# Altium project SpaceVNXBaseBoard.PrjPcb (part 5 of 6)

## Sheet ZynqPower.SchDoc
size A3; Author: Carlos Barreiro; Organization: Escuela Técnica Superior de Ingeniería de Sistemas Informáticos de la Universidad Politécnica de Madrid; Address1: Campus Sur de la Universidad Politécnica de Madrid; Address2: Calle de Alan Turing, s/nº; Address3: Madrid 28031; Address4: España; DocumentNumber: 9; SheetNumber: 9; SheetTotal: 16
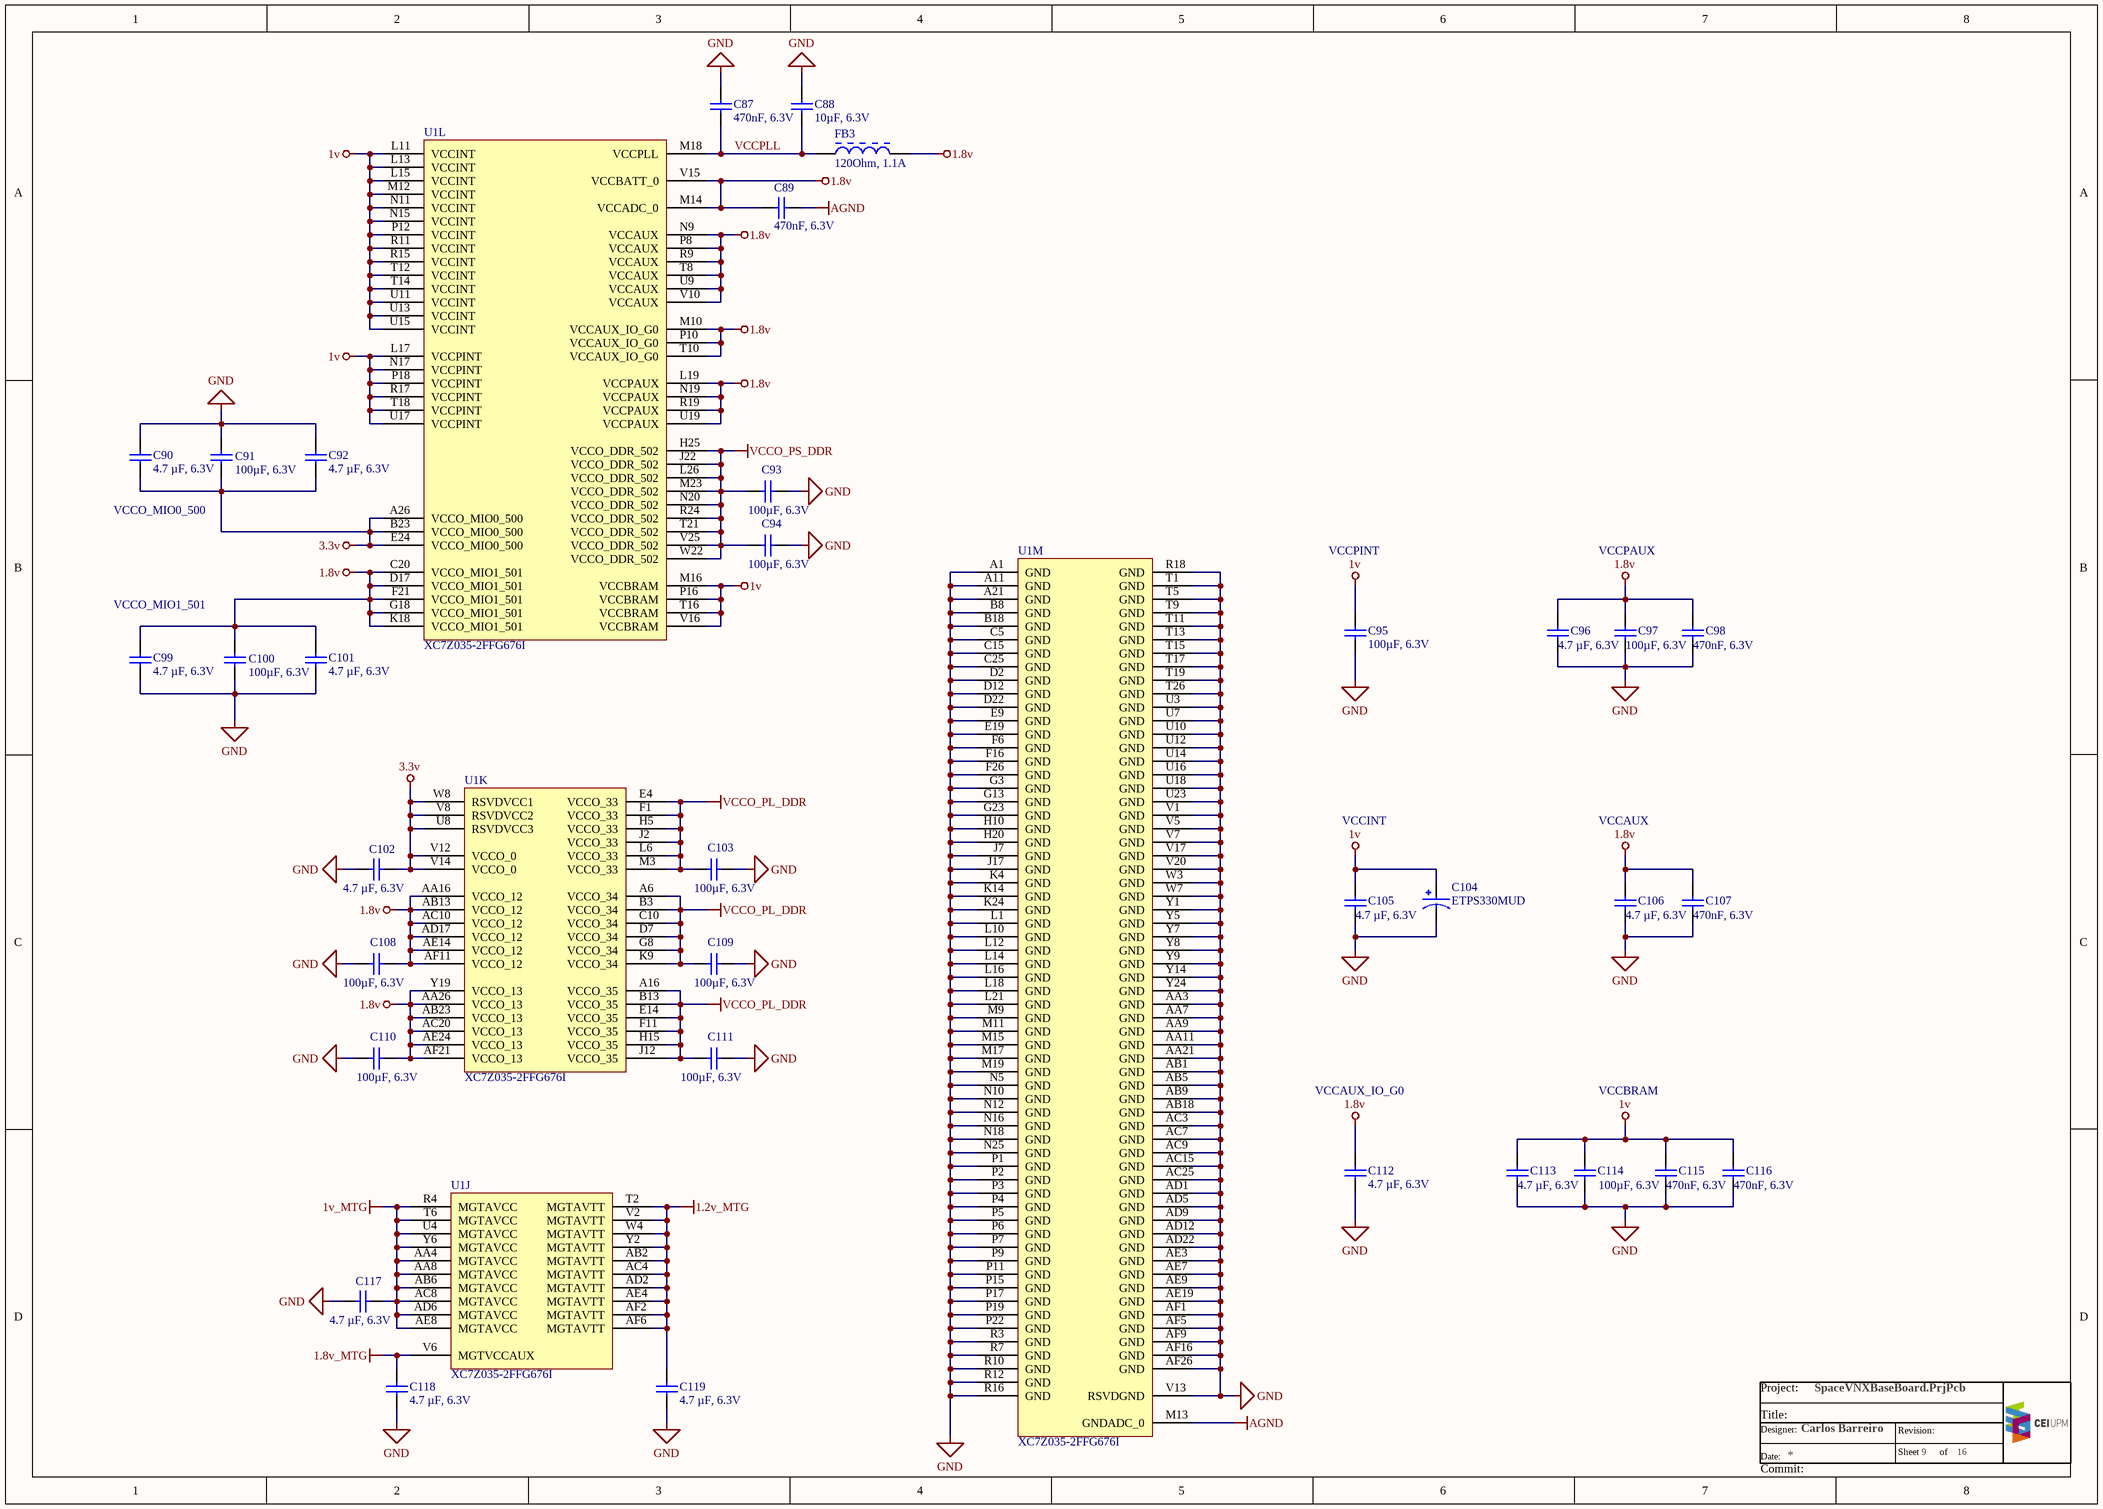
[diagram p12: ZynqPower.SchDoc]

### Parts
C87  470nF, 6.3V  [WURTH_WCAP-CSGP_0402]
C88  10µF, 6.3V  [WURTH_WCAP-CSGP_0402]
C89  470nF, 6.3V  [WURTH_WCAP-CSGP_0402]
C90  4.7 µF, 6.3V  [WURTH_WCAP-CSGP_0402]
C91  100µF, 6.3V  [WURTH_WCAP-CSGP_1206_H=1.6mm]
C92  4.7 µF, 6.3V  [WURTH_WCAP-CSGP_0402]
C93  100µF, 6.3V  [WURTH_WCAP-CSGP_1206_H=1.6mm]
C94  100µF, 6.3V  [WURTH_WCAP-CSGP_1206_H=1.6mm]
C95  100µF, 6.3V  [WURTH_WCAP-CSGP_1206_H=1.6mm]
C96  4.7 µF, 6.3V  [WURTH_WCAP-CSGP_0402]
C97  100µF, 6.3V  [WURTH_WCAP-CSGP_1206_H=1.6mm]
C98  470nF, 6.3V  [WURTH_WCAP-CSGP_0402]
C99  4.7 µF, 6.3V  [WURTH_WCAP-CSGP_0402]
C100  100µF, 6.3V  [WURTH_WCAP-CSGP_1206_H=1.6mm]
C101  4.7 µF, 6.3V  [WURTH_WCAP-CSGP_0402]
C102  4.7 µF, 6.3V  [WURTH_WCAP-CSGP_0402]
C103  100µF, 6.3V  [WURTH_WCAP-CSGP_1206_H=1.6mm]
C104  ETPS330MUD  [PANASONIC_B1S]
C105  4.7 µF, 6.3V  [WURTH_WCAP-CSGP_0402]
C106  4.7 µF, 6.3V  [WURTH_WCAP-CSGP_0402]
C107  470nF, 6.3V  [WURTH_WCAP-CSGP_0402]
C108  100µF, 6.3V  [WURTH_WCAP-CSGP_1206_H=1.6mm]
C109  100µF, 6.3V  [WURTH_WCAP-CSGP_1206_H=1.6mm]
C110  100µF, 6.3V  [WURTH_WCAP-CSGP_1206_H=1.6mm]
C111  100µF, 6.3V  [WURTH_WCAP-CSGP_1206_H=1.6mm]
C112  4.7 µF, 6.3V  [WURTH_WCAP-CSGP_0402]
C113  4.7 µF, 6.3V  [WURTH_WCAP-CSGP_0402]
C114  100µF, 6.3V  [WURTH_WCAP-CSGP_1206_H=1.6mm]
C115  470nF, 6.3V  [WURTH_WCAP-CSGP_0402]
C116  470nF, 6.3V  [WURTH_WCAP-CSGP_0402]
C117  4.7 µF, 6.3V  [WURTH_WCAP-CSGP_0402]
C118  4.7 µF, 6.3V  [WURTH_WCAP-CSGP_0402]
C119  4.7 µF, 6.3V  [WURTH_WCAP-CSGP_0402]
FB3  120Ohm, 1.1A  [WURTH-CBF_0402]
U1  XC7Z035-2FFG676I  [XILINX_FBG676]  (parts J,K,L,M of 13)

### Nets
1.2v_MTG: C119.2 U1.AB2(MGTAVTT) U1.AC4(MGTAVTT) U1.AD2(MGTAVTT) U1.AE4(MGTAVTT) U1.AF2(MGTAVTT) U1.AF6(MGTAVTT) U1.T2(MGTAVTT) U1.V2(MGTAVTT) U1.W4(MGTAVTT) U1.Y2(MGTAVTT)
1.8v: C89.2 C96.1 C97.2 C98.2 C99.2 C100.1 C101.2 C106.2 C107.2 C108.1 C110.1 C112.2 FB3.2 U1.AA16(VCCO_12) U1.AA26(VCCO_13) U1.AB13(VCCO_12) U1.AB23(VCCO_13) U1.AC10(VCCO_12) U1.AC20(VCCO_13) U1.AD17(VCCO_12) U1.AE14(VCCO_12) U1.AE24(VCCO_13) U1.AF11(VCCO_12) U1.AF21(VCCO_13) U1.C20(VCCO_MIO1_501) U1.D17(VCCO_MIO1_501) U1.F21(VCCO_MIO1_501) U1.G18(VCCO_MIO1_501) U1.K18(VCCO_MIO1_501) U1.L19(VCCPAUX) U1.M10(VCCAUX_IO_G0) U1.M14(VCCADC_0) U1.N9(VCCAUX) U1.N19(VCCPAUX) U1.P8(VCCAUX) U1.P10(VCCAUX_IO_G0) U1.R9(VCCAUX) U1.R19(VCCPAUX) U1.T8(VCCAUX) U1.T10(VCCAUX_IO_G0) U1.U9(VCCAUX) U1.U19(VCCPAUX) U1.V10(VCCAUX) U1.V15(VCCBATT_0) U1.Y19(VCCO_13)
1.8v_MTG: C118.2 U1.V6(MGTVCCAUX)
1v: C95.2 C104.1 C105.1 C113.1 C114.2 C115.2 C116.2 U1.L11(VCCINT) U1.L13(VCCINT) U1.L15(VCCINT) U1.L17(VCCPINT) U1.M12(VCCINT) U1.M16(VCCBRAM) U1.N11(VCCINT) U1.N15(VCCINT) U1.N17(VCCPINT) U1.P12(VCCINT) U1.P16(VCCBRAM) U1.P18(VCCPINT) U1.R11(VCCINT) U1.R15(VCCINT) U1.R17(VCCPINT) U1.T12(VCCINT) U1.T14(VCCINT) U1.T16(VCCBRAM) U1.T18(VCCPINT) U1.U11(VCCINT) U1.U13(VCCINT) U1.U15(VCCINT) U1.U17(VCCPINT) U1.V16(VCCBRAM)
1v_MTG: C117.2 U1.AA4(MGTAVCC) U1.AA8(MGTAVCC) U1.AB6(MGTAVCC) U1.AC8(MGTAVCC) U1.AD6(MGTAVCC) U1.AE8(MGTAVCC) U1.R4(MGTAVCC) U1.T6(MGTAVCC) U1.U4(MGTAVCC) U1.Y6(MGTAVCC)
3.3v: C90.2 C91.1 C92.2 C102.2 U1.A26(VCCO_MIO0_500) U1.B23(VCCO_MIO0_500) U1.E24(VCCO_MIO0_500) U1.U8(RSVDVCC3) U1.V8(RSVDVCC2) U1.V12(VCCO_0) U1.V14(VCCO_0) U1.W8(RSVDVCC1)
AGND: C89.1 U1.M13(GNDADC_0)
GND: C87.2 C88.2 C90.1 C91.2 C92.1 C93.2 C94.2 C95.1 C96.2 C97.1 C98.1 C99.1 C100.2 C101.1 C102.1 C103.2 C104.2 C105.2 C106.1 C107.1 C108.2 C109.2 C110.2 C111.2 C112.1 C113.2 C114.1 C115.1 C116.1 C117.1 C118.1 C119.1 U1.A1(GND) U1.A11(GND) U1.A21(GND) U1.AA3(GND) U1.AA7(GND) U1.AA9(GND) U1.AA11(GND) U1.AA21(GND) U1.AB1(GND) U1.AB5(GND) U1.AB9(GND) U1.AB18(GND) U1.AC3(GND) U1.AC7(GND) U1.AC9(GND) U1.AC15(GND) U1.AC25(GND) U1.AD1(GND) U1.AD5(GND) U1.AD9(GND) U1.AD12(GND) U1.AD22(GND) U1.AE3(GND) U1.AE7(GND) U1.AE9(GND) U1.AE19(GND) U1.AF1(GND) U1.AF5(GND) U1.AF9(GND) U1.AF16(GND) U1.AF26(GND) U1.B8(GND) U1.B18(GND) U1.C5(GND) U1.C15(GND) U1.C25(GND) U1.D2(GND) U1.D12(GND) U1.D22(GND) U1.E9(GND) U1.E19(GND) U1.F6(GND) U1.F16(GND) U1.F26(GND) U1.G3(GND) U1.G13(GND) U1.G23(GND) U1.H10(GND) U1.H20(GND) U1.J7(GND) U1.J17(GND) U1.K4(GND) U1.K14(GND) U1.K24(GND) U1.L1(GND) U1.L10(GND) U1.L12(GND) U1.L14(GND) U1.L16(GND) U1.L18(GND) U1.L21(GND) U1.M9(GND) U1.M11(GND) U1.M15(GND) U1.M17(GND) U1.M19(GND) U1.N5(GND) U1.N10(GND) U1.N12(GND) U1.N16(GND) U1.N18(GND) U1.N25(GND) U1.P1(GND) U1.P2(GND) U1.P3(GND) U1.P4(GND) U1.P5(GND) U1.P6(GND) U1.P7(GND) U1.P9(GND) U1.P11(GND) U1.P15(GND) U1.P17(GND) U1.P19(GND) U1.P22(GND) U1.R3(GND) U1.R7(GND) U1.R10(GND) U1.R12(GND) U1.R16(GND) U1.R18(GND) U1.T1(GND) U1.T5(GND) U1.T9(GND) U1.T11(GND) U1.T13(GND) U1.T15(GND) U1.T17(GND) U1.T19(GND) U1.T26(GND) U1.U3(GND) U1.U7(GND) U1.U10(GND) U1.U12(GND) U1.U14(GND) U1.U16(GND) U1.U18(GND) U1.U23(GND) U1.V1(GND) U1.V5(GND) U1.V7(GND) U1.V13(RSVDGND) U1.V17(GND) U1.V20(GND) U1.W3(GND) U1.W7(GND) U1.Y1(GND) U1.Y5(GND) U1.Y7(GND) U1.Y8(GND) U1.Y9(GND) U1.Y14(GND) U1.Y24(GND)
VCCO_PL_DDR: C103.1 C109.1 C111.1 U1.A6(VCCO_34) U1.A16(VCCO_35) U1.B3(VCCO_34) U1.B13(VCCO_35) U1.C10(VCCO_34) U1.D7(VCCO_34) U1.E4(VCCO_33) U1.E14(VCCO_35) U1.F1(VCCO_33) U1.F11(VCCO_35) U1.G8(VCCO_34) U1.H5(VCCO_33) U1.H15(VCCO_35) U1.J2(VCCO_33) U1.J12(VCCO_35) U1.K9(VCCO_34) U1.L6(VCCO_33) U1.M3(VCCO_33)
VCCO_PS_DDR: C93.1 C94.1 U1.H25(VCCO_DDR_502) U1.J22(VCCO_DDR_502) U1.L26(VCCO_DDR_502) U1.M23(VCCO_DDR_502) U1.N20(VCCO_DDR_502) U1.R24(VCCO_DDR_502) U1.T21(VCCO_DDR_502) U1.V25(VCCO_DDR_502) U1.W22(VCCO_DDR_502)
VCCPLL: C87.1 C88.1 FB3.1 U1.M18(VCCPLL)

### Notes on the sheet
- VCCO_MIO0_500
- VCCPINT
- VCCPAUX
- VCCO_MIO1_501
- VCCINT
- VCCAUX
- VCCAUX_IO_G0
- VCCBRAM
- Project:
- Title:
- Date:
- Designer:
- Sheet
- Revision:
- of
- Commit:

### Library data of the parts
C87 C89 C98 C107 C115 C116 = 885012105004: as C120 on sheet Clock; ComponentLink1Description: Manufacturer; ComponentLink1URL: http://www.we-online.de; ComponentLink2Description: Datasheet; ComponentLink2URL: https://www.we-online.com/catalog/datasheet/885012105004.pdf; Operating Temperature: -55 to +85degC; Packaging: Tape and Reel; Manufacturer Part Number: 885012105004; Published Date: April 2021; Ceramic Type: X5R; Height: 0.5mm; Mounting Technology: SMT; Size: 0402; Capacitance: 470nF; Supplier 1: Digi-Key; Supplier 2: Mouser; Supplier Part Number 1: 732-7481-1-ND; Supplier Part Number 2: 710-885012105004
C88 = 885012105020: as C121 on sheet Clock; ComponentLink1Description: Manufacturer; ComponentLink1URL: http://www.we-online.de; ComponentLink2Description: Datasheet; ComponentLink2URL: https://www.we-online.com/catalog/datasheet/885012105020.pdf; Operating Temperature: -55 to +85degC; Packaging: Tape and Reel; Manufacturer Part Number: 885012105020; Published Date: April 2021; Ceramic Type: X5R; Height: 0.5mm; Mounting Technology: SMT; Size: 0402; Capacitance: 10uF; Q-Factor min.: -
C90 C92 C96 C99 C101 C102 C105 C106 C112 C113 C117-C119 = GRM155C80J475MEAAD: Multilayer Ceramic Capacitors MLCC, size 0402, X5R, 4.7 µF, 6.3V; Manufacturer: Murata; Rated Voltage: 6.3VDC; Ceramic Type: X6S; Capacitance Tolerance: +/-20%; Dissipation Factor max.: 10%; Capacitance: 4.7 µF; Operating Temperature: -55 to +105degC; Packaging: Tape and Reel; Manufacturer Part Number: GRM155C80J475MEAAD; Height: 0.5mm; Mounting Technology: SMT; Size: 0402; Supplier 1: Digi-Key; Supplier 2: Mouser; Supplier Part Number 1: 490-14458-1-ND; Supplier Part Number 2: 81-GRM155C80J475MEAD
C91 C93-C95 C97 C100 C103 C108-C111 C114 = 885012108005: WCAP-CSGP Multilayer Ceramic Chip Capacitor, General Purpose, size 1206, X5R, 100uF, 6.3V; Manufacturer: Wurth Elektronik; Rated Voltage: 6.3VDC; Isolation Resistance  min.: 0.001GOhm; Capacitance Tolerance: +/-20%; Dissipation Factor max.: 10%; Technical Reference: X5R1206107M6R3DFCT10000; ComponentLink1Description: Manufacturer; ComponentLink1URL: http://www.we-online.de; ComponentLink2Description: Datasheet; ComponentLink2URL: https://www.we-online.com/catalog/datasheet/885012108005.pdf; Operating Temperature: -55 to +85degC; Packaging: Tape and Reel; Manufacturer Part Number: 885012108005; Published Date: April 2021; Ceramic Type: X5R; Height: 1.6mm; Mounting Technology: SMT; Size: 1206; Capacitance: 100uF; Q-Factor min.: -
C104 = ETPS330MUD: Conductive Polymer Tantalum Solid Capacitors; Rated capacitance range (µF): 330.00; Rated voltage (DC) (V): 2.50; MF: Panasonic; Package: B1S; MP: ETPS330MUD; Supplier 1: Digi-Key; Supplier Part Number 1: 10-ETPS330MUDDKR-ND
FB3 = 74279271: as FB4 on sheet Clock; ComponentLink1Description: Manufacturer; ComponentLink1URL: http://www.we-online.de; ComponentLink2Description: Datasheet; ComponentLink2URL: https://www.we-online.com/catalog/datasheet/74279271.pdf; Operating Temperature: -55 to +125degC; Packaging: Tape and Reel; Published Date: December 2021; Rated Current: 1.1A; Manufacturer Part Number: 74279271; Impedance @100MHz: 120Ohm; Mounting Technology: SMT; Size: 0402; Height: 0.5mm; Length: 1mm; Width: 0.5mm
U1 = XC7Z035-2FFG676I: 667 MHz Zynq™-7000 AP SoC, 130 PS I/O, 254 FPGA I/O, 676-Ball BGA, Speed Grade 1, Commercial Grade, Pb-Free; PartNumber: XC7Z035-2FBG676I; LUTs: 171,900; Extensible Block RAM (# 36Kb Blocks): 17.6Mb (500); Speed Grade: -2; Flip Flops: 343,800; ComponentLink5Description: Packaging and Pinout; ComponentLink4Description: Package File; ComponentLink5URL: http://www.xilinx.com/support/documentation/user_guides/ug865-Zynq-7000-Pkg-Pinout.pdf; Generic Part Number: XC7Z035; ComponentLink1Description: Datasheet; ComponentLink2Description: Package Specification; ComponentLink3URL: http://www.xilinx.com/support/documentation/data_sheets/ds191-XC7Z030-XC7Z045-data-sheet.pdf; ComponentLink1URL: http://www.xilinx.com/support/documentation/data_sheets/ds190-Zynq-7000-Overview.pdf; ComponentLink6Description: PCB and Layout Guide; Package: FBG676; ComponentLink3Description: DC and AC Switching Characteristics; ComponentLink6URL: http://www.xilinx.com/support/documentation/user_guides/ug483_7Series_PCB.pdf; RoHS: Pb-Free; ComponentLink4URL: http://www.xilinx.com/support/packagefiles/z7packages/xc7z030fbg676pkg.txt; ComponentLink2URL: http://www.xilinx.com/support/documentation/user_guides/ug475_7Series_Pkg_Pinout.pdf; PackageDescription: Flip-Chip Lidless BGA, Body 27 x 27 mm, 1.0 mm Pitch; Supplier 1: Digi-Key; Supplier 2: Mouser; Supplier Part Number 1: XC7Z035-2FFG676I-ND; Supplier Part Number 2: 217-XC7Z035-2FFG676I

## Sheet PS_Ethernet.SchDoc: PS_Ethernet
size A3; Author: Carlos Barreiro; Organization: Escuela Técnica Superior de Ingeniería de Sistemas Informáticos de la Universidad Politécnica de Madrid; Address1: Campus Sur de la Universidad Politécnica de Madrid; Address2: Calle de Alan Turing, s/nº; Address3: Madrid 28031; Address4: España; DocumentNumber: 14; Revision: A; SheetNumber: 14; SheetTotal: 16
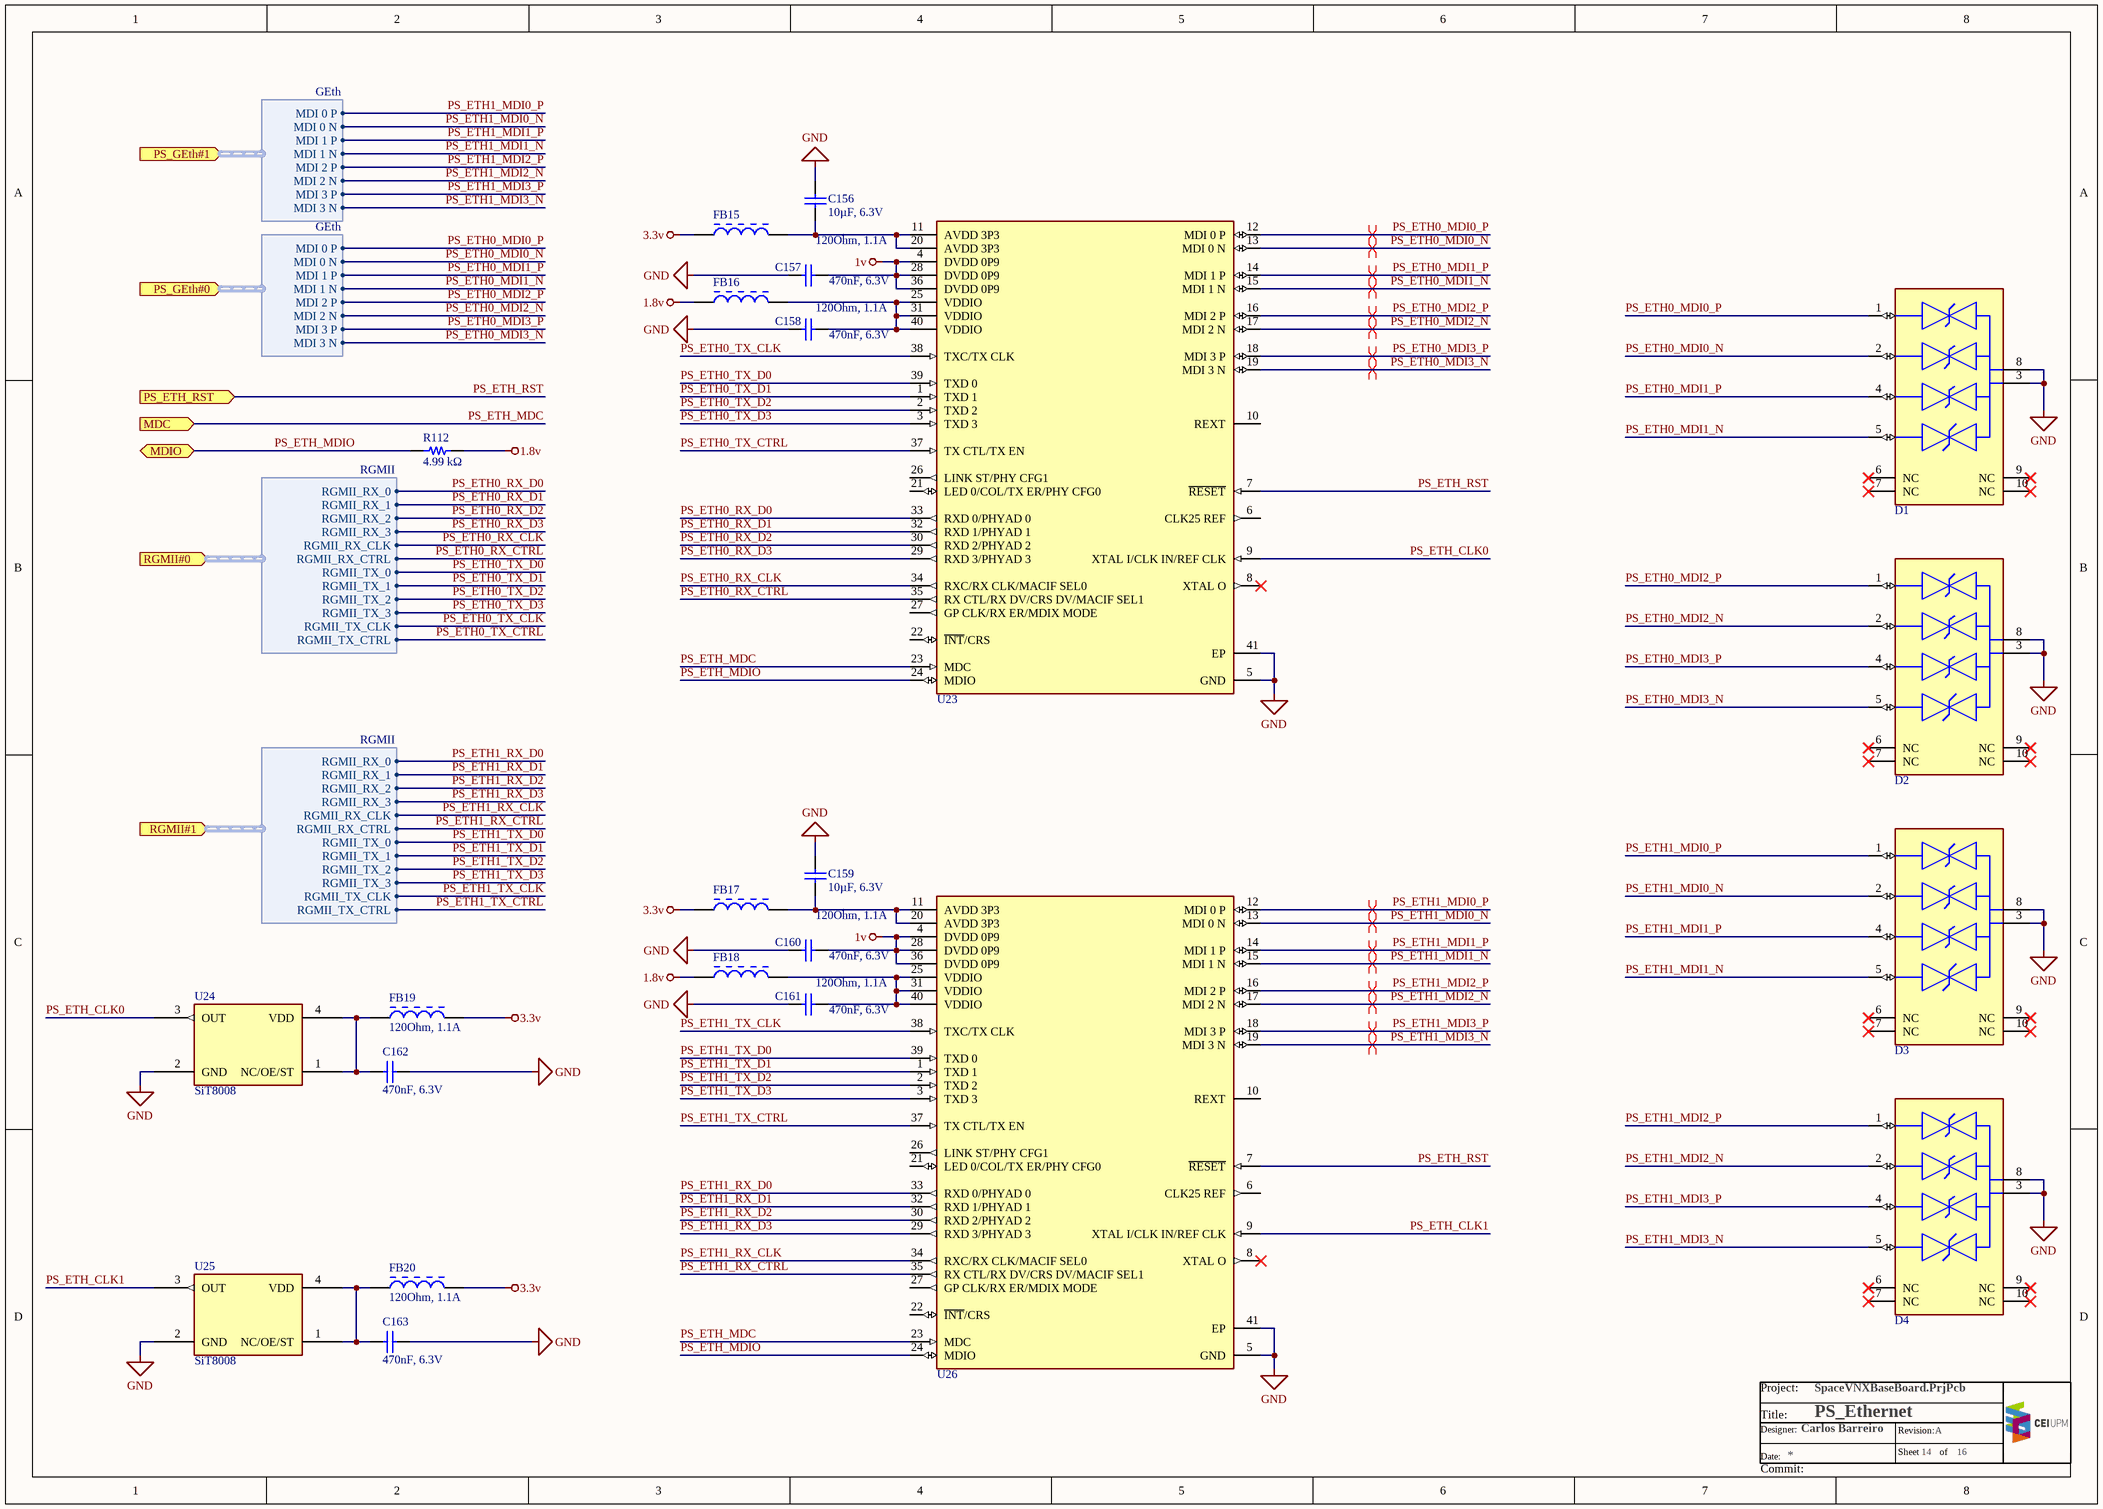
[diagram p13: PS_Ethernet.SchDoc]

### Parts
C156  10µF, 6.3V  [WURTH_WCAP-CSGP_0402]
C157  470nF, 6.3V  [WURTH_WCAP-CSGP_0402]
C158  470nF, 6.3V  [WURTH_WCAP-CSGP_0402]
C159  10µF, 6.3V  [WURTH_WCAP-CSGP_0402]
C160  470nF, 6.3V  [WURTH_WCAP-CSGP_0402]
C161  470nF, 6.3V  [WURTH_WCAP-CSGP_0402]
C162  470nF, 6.3V  [WURTH_WCAP-CSGP_0402]
C163  470nF, 6.3V  [WURTH_WCAP-CSGP_0402]
D1  ESD204DQAR  [TEXAS_USON10]  (value not drawn)
D2  ESD204DQAR  [TEXAS_USON10]  (value not drawn)
D3  ESD204DQAR  [TEXAS_USON10]  (value not drawn)
D4  ESD204DQAR  [TEXAS_USON10]  (value not drawn)
FB15  120Ohm, 1.1A  [WURTH-CBF_0402]
FB16  120Ohm, 1.1A  [WURTH-CBF_0402]
FB17  120Ohm, 1.1A  [WURTH-CBF_0402]
FB18  120Ohm, 1.1A  [WURTH-CBF_0402]
FB19  120Ohm, 1.1A  [WURTH-CBF_0402]
FB20  120Ohm, 1.1A  [WURTH-CBF_0402]
R112  4.99 kΩ  [PANASONIC_ERJ2G_0402]
U23  ADIN1300CCPZ  [ADI_LFCSP40]  (value not drawn)
U24  SiT8008  [SiTime_5032_4]
U25  SiT8008  [SiTime_5032_4]
U26  ADIN1300CCPZ  [ADI_LFCSP40]  (value not drawn)

### Ports
MDC (in), MDIO (bidir), PS_ETH_RST (in), PS_GEth#0 (in, harness GEth), PS_GEth#1 (in, harness GEth), RGMII#0 (in, harness RGMII), RGMII#1 (in, harness RGMII)

### Harnesses
RGMII: RGMII_RX_0, RGMII_RX_1, RGMII_RX_2, RGMII_RX_3, RGMII_RX_CLK, RGMII_RX_CTRL, RGMII_TX_0, RGMII_TX_1, RGMII_TX_2, RGMII_TX_3, RGMII_TX_CLK, RGMII_TX_CTRL
GEth: MDI 0 P, MDI 0 N, MDI 1 P, MDI 1 N, MDI 2 P, MDI 2 N, MDI 3 P, MDI 3 N

### Nets
1.8v: FB16.1 FB18.1 R112.2
1v: C157.2 C160.2 U23.4(DVDD_0P9) U23.28(DVDD_0P9) U23.36(DVDD_0P9) U26.4(DVDD_0P9) U26.28(DVDD_0P9) U26.36(DVDD_0P9)
3.3v: FB15.1 FB17.1 FB19.2 FB20.2
GND: C156.2 C157.1 C158.1 C159.2 C160.1 C161.1 C162.1 C163.1 D1.3(GND) D1.8(GND) D2.3(GND) D2.8(GND) D3.3(GND) D3.8(GND) D4.3(GND) D4.8(GND) U23.5(GND) U23.41(EP) U24.2(GND) U25.2(GND) U26.5(GND) U26.41(EP)
PS_ETH0_MDI0_N: D1.2(IO2) U23.13(MDI_0_N) ; port PS_GEth#0.MDI 0 N
PS_ETH0_MDI0_P: D1.1(IO1) U23.12(MDI_0_P) ; port PS_GEth#0.MDI 0 P
PS_ETH0_MDI1_N: D1.5(IO4) U23.15(MDI_1_N) ; port PS_GEth#0.MDI 1 N
PS_ETH0_MDI1_P: D1.4(IO3) U23.14(MDI_1_P) ; port PS_GEth#0.MDI 1 P
PS_ETH0_MDI2_N: D2.2(IO2) U23.17(MDI_2_N) ; port PS_GEth#0.MDI 2 N
PS_ETH0_MDI2_P: D2.1(IO1) U23.16(MDI_2_P) ; port PS_GEth#0.MDI 2 P
PS_ETH0_MDI3_N: D2.5(IO4) U23.19(MDI_3_N) ; port PS_GEth#0.MDI 3 N
PS_ETH0_MDI3_P: D2.4(IO3) U23.18(MDI_3_P) ; port PS_GEth#0.MDI 3 P
PS_ETH0_RX_CLK: U23.34(RXC/RX_CLK/MACIF_SEL0) ; port RGMII#0.RGMII_RX_CLK
PS_ETH0_RX_CTRL: U23.35(RX_CTL/RX_DV/CRS_DV/MACIF_SEL1) ; port RGMII#0.RGMII_RX_CTRL
PS_ETH0_RX_D0: U23.33(RXD_0/PHYAD_0) ; port RGMII#0.RGMII_RX_0
PS_ETH0_RX_D1: U23.32(RXD_1/PHYAD_1) ; port RGMII#0.RGMII_RX_1
PS_ETH0_RX_D2: U23.30(RXD_2/PHYAD_2) ; port RGMII#0.RGMII_RX_2
PS_ETH0_RX_D3: U23.29(RXD_3/PHYAD_3) ; port RGMII#0.RGMII_RX_3
PS_ETH0_TX_CLK: U23.38(TXC/TX_CLK) ; port RGMII#0.RGMII_TX_CLK
PS_ETH0_TX_CTRL: U23.37(TX_CTL/TX_EN) ; port RGMII#0.RGMII_TX_CTRL
PS_ETH0_TX_D0: U23.39(TXD_0) ; port RGMII#0.RGMII_TX_0
PS_ETH0_TX_D1: U23.1(TXD_1) ; port RGMII#0.RGMII_TX_1
PS_ETH0_TX_D2: U23.2(TXD_2) ; port RGMII#0.RGMII_TX_2
PS_ETH0_TX_D3: U23.3(TXD_3) ; port RGMII#0.RGMII_TX_3
PS_ETH1_MDI0_N: D3.2(IO2) U26.13(MDI_0_N) ; port PS_GEth#1.MDI 0 N
PS_ETH1_MDI0_P: D3.1(IO1) U26.12(MDI_0_P) ; port PS_GEth#1.MDI 0 P
PS_ETH1_MDI1_N: D3.5(IO4) U26.15(MDI_1_N) ; port PS_GEth#1.MDI 1 N
PS_ETH1_MDI1_P: D3.4(IO3) U26.14(MDI_1_P) ; port PS_GEth#1.MDI 1 P
PS_ETH1_MDI2_N: D4.2(IO2) U26.17(MDI_2_N) ; port PS_GEth#1.MDI 2 N
PS_ETH1_MDI2_P: D4.1(IO1) U26.16(MDI_2_P) ; port PS_GEth#1.MDI 2 P
PS_ETH1_MDI3_N: D4.5(IO4) U26.19(MDI_3_N) ; port PS_GEth#1.MDI 3 N
PS_ETH1_MDI3_P: D4.4(IO3) U26.18(MDI_3_P) ; port PS_GEth#1.MDI 3 P
PS_ETH1_RX_CLK: U26.34(RXC/RX_CLK/MACIF_SEL0) ; port RGMII#1.RGMII_RX_CLK
PS_ETH1_RX_CTRL: U26.35(RX_CTL/RX_DV/CRS_DV/MACIF_SEL1) ; port RGMII#1.RGMII_RX_CTRL
PS_ETH1_RX_D0: U26.33(RXD_0/PHYAD_0) ; port RGMII#1.RGMII_RX_0
PS_ETH1_RX_D1: U26.32(RXD_1/PHYAD_1) ; port RGMII#1.RGMII_RX_1
PS_ETH1_RX_D2: U26.30(RXD_2/PHYAD_2) ; port RGMII#1.RGMII_RX_2
PS_ETH1_RX_D3: U26.29(RXD_3/PHYAD_3) ; port RGMII#1.RGMII_RX_3
PS_ETH1_TX_CLK: U26.38(TXC/TX_CLK) ; port RGMII#1.RGMII_TX_CLK
PS_ETH1_TX_CTRL: U26.37(TX_CTL/TX_EN) ; port RGMII#1.RGMII_TX_CTRL
PS_ETH1_TX_D0: U26.39(TXD_0) ; port RGMII#1.RGMII_TX_0
PS_ETH1_TX_D1: U26.1(TXD_1) ; port RGMII#1.RGMII_TX_1
PS_ETH1_TX_D2: U26.2(TXD_2) ; port RGMII#1.RGMII_TX_2
PS_ETH1_TX_D3: U26.3(TXD_3) ; port RGMII#1.RGMII_TX_3
PS_ETH_CLK0: U23.9(XTAL_I/CLK_IN/REF_CLK) U24.3(OUT)
PS_ETH_CLK1: U25.3(OUT) U26.9(XTAL_I/CLK_IN/REF_CLK)
PS_ETH_MDC: U23.23(MDC) U26.23(MDC) ; port MDC
PS_ETH_MDIO: R112.1 U23.24(MDIO) U26.24(MDIO) ; port MDIO
PS_ETH_RST: U23.7(~{RESET}) U26.7(~{RESET}) ; port PS_ETH_RST
NetC156_1: C156.1 FB15.2 U23.11(AVDD_3P3) U23.20(AVDD_3P3)
NetC158_2: C158.2 FB16.2 U23.25(VDDIO) U23.31(VDDIO) U23.40(VDDIO)
NetC159_1: C159.1 FB17.2 U26.11(AVDD_3P3) U26.20(AVDD_3P3)
NetC161_2: C161.2 FB18.2 U26.25(VDDIO) U26.31(VDDIO) U26.40(VDDIO)
NetC162_2: C162.2 FB19.1 U24.1(NC/OE/ST) U24.4(VDD)
NetC163_2: C163.2 FB20.1 U25.1(NC/OE/ST) U25.4(VDD)

Not connected (* = marked no-connect by the designer): D1 6(NC)* 7(NC)* 9(NC)* 10(NC)*; D2 6(NC)* 7(NC)* 9(NC)* 10(NC)*; D3 6(NC)* 7(NC)* 9(NC)* 10(NC)*; D4 6(NC)* 7(NC)* 9(NC)* 10(NC)*; U23 6(CLK25_REF) 8(XTAL_O)* 10(REXT) 21(LED_0/COL/TX_ER/PHY_CFG0) 22(~{INT}/CRS) 26(LINK_ST/PHY_CFG1) 27(GP_CLK/RX_ER/MDIX_MODE); U26 6(CLK25_REF) 8(XTAL_O)* 10(REXT) 21(LED_0/COL/TX_ER/PHY_CFG0) 22(~{INT}/CRS) 26(LINK_ST/PHY_CFG1) 27(GP_CLK/RX_ER/MDIX_MODE)

### Layout directives
differential pair: PS_ETH0_MDI0_N, PS_ETH0_MDI0_P, PS_ETH0_MDI1_N, PS_ETH0_MDI1_P, PS_ETH0_MDI2_N, PS_ETH0_MDI2_P, PS_ETH0_MDI3_N, PS_ETH0_MDI3_P, PS_ETH1_MDI0_N, PS_ETH1_MDI0_P, PS_ETH1_MDI1_N, PS_ETH1_MDI1_P, PS_ETH1_MDI2_N, PS_ETH1_MDI2_P, PS_ETH1_MDI3_N, PS_ETH1_MDI3_P

### Notes on the sheet
- Project:
- Title:
- Date:
- Designer:
- Sheet
- Revision:
- of
- Commit:

### Library data of the parts
C156 C159 = 885012105020: as C121 on sheet Clock; ComponentLink1Description: Manufacturer; ComponentLink1URL: http://www.we-online.de; ComponentLink2Description: Datasheet; ComponentLink2URL: https://www.we-online.com/catalog/datasheet/885012105020.pdf; Operating Temperature: -55 to +85degC; Packaging: Tape and Reel; Manufacturer Part Number: 885012105020; Published Date: April 2021; Ceramic Type: X5R; Height: 0.5mm; Mounting Technology: SMT; Size: 0402; Capacitance: 10uF; Q-Factor min.: -
C157 C158 C160-C163 = 885012105004: as C120 on sheet Clock; ComponentLink1Description: Manufacturer; ComponentLink1URL: http://www.we-online.de; ComponentLink2Description: Datasheet; ComponentLink2URL: https://www.we-online.com/catalog/datasheet/885012105004.pdf; Operating Temperature: -55 to +85degC; Packaging: Tape and Reel; Manufacturer Part Number: 885012105004; Published Date: April 2021; Ceramic Type: X5R; Height: 0.5mm; Mounting Technology: SMT; Size: 0402; Capacitance: 470nF; Supplier 1: Digi-Key; Supplier 2: Mouser; Supplier Part Number 1: 732-7481-1-ND; Supplier Part Number 2: 710-885012105004
D1-D4 = ESD204DQAR: ESD204 4-Channel Low-Capacitance Surge and ESD Protection Diode; Number of channels (#): 4; IO capacitance (Typ) (pF): 0.55; Vrwm (V): 3.6; Bi-/uni-directional: Bi-Directional; IO leakage current (Max) (nA): 10; Rating: Catalog; Dynamic resistance (Typ) (Ω): 0.3; Clamping voltage (V): 11.5; Operating temperature range (C): -40ºC to 125ºC; ComponentLink1Description: Manufacturer; ComponentLink1URL: https://www.ti.com/product/ESD204; Supplier 1: Digi-Key; Supplier 2: Mouser; Supplier Part Number 1: 296-49504-1-ND; Supplier Part Number 2: 595-ESD204DQAR
FB15-FB20 = 74279271: as FB4 on sheet Clock; ComponentLink1Description: Manufacturer; ComponentLink1URL: http://www.we-online.de; ComponentLink2Description: Datasheet; ComponentLink2URL: https://www.we-online.com/catalog/datasheet/74279271.pdf; Operating Temperature: -55 to +125degC; Packaging: Tape and Reel; Published Date: December 2021; Rated Current: 1.1A; Manufacturer Part Number: 74279271; Impedance @100MHz: 120Ohm; Mounting Technology: SMT; Size: 0402; Height: 0.5mm; Length: 1mm; Width: 0.5mm
R112 = ERJ2RKF4991X: as R91 on sheet PowerSupply; Size (0402): 2GE; ComponentLink1Description: Catalog; ComponentLink1URL: https://industrial.panasonic.com/ww/products/pt/general-purpose-chip-resistors/models?op=search&model_status_current=1&page=0#model-list-search-results; Series: ERJ; Temperature Range (ºC): -55 to +155; Supplier 1: Digi-Key; Supplier Part Number 1: P4.99KLTR-ND
U23 U26 = ADIN1300CCPZ: Robust, Industrial, Low Latency and Low Power 10 Mbps, 100 Mbps, and 1 Gbps Ethernet PHY; MAC Interface: MII, RMII, RGMII; Package: 40-lead, 6 mm × 6 mm LFCSP; Operating Temperature: −40°C to +105°C; ComponentLink1Description: Manufacturer; ComponentLink1URL: https://www.analog.com/en/products/adin1300.html#product-tools; ComponentLink2Description: Application Note; ComponentLink2URL: https://wiki.analog.com/resources/eval/user-guides/adin1300-and-adin1200/cap-coupling#:~:text=The%20ADIN1300%20and%20ADIN1200%20are,10%2F100%20Mbps%20Ethernet%20speeds.; Supplier 1: Digi-Key; Supplier 2: Mouser; Supplier Part Number 2: 584-ADIN1300CCPZ; Supplier Part Number 1: 505-ADIN1300CCPZ-ND
U24 U25 = SiT8008: as U18 on sheet Clock; Operating Temperature Range (°C): -40ºC to +85ºC; ComponentLink1Description: Manufacturer; ComponentLink1URL: https://www.sitime.com/products/lvcmos-oscillators/sit8008; Supplier 1: Mouser; Supplier Part Number 1: 788-8008BI2333S1000G

## Sheet CANTransceiver.SchDoc: CANTransceiver
size A4; Author: Carlos Barreiro; Organization: Escuela Técnica Superior de Ingeniería de Sistemas Informáticos de la Universidad Politécnica de Madrid; Address1: Campus Sur de la Universidad Politécnica de Madrid; Address2: Calle de Alan Turing, s/nº; Address3: Madrid 28031; Address4: España; DocumentNumber: 16; Revision: A; SheetNumber: 16; SheetTotal: 16
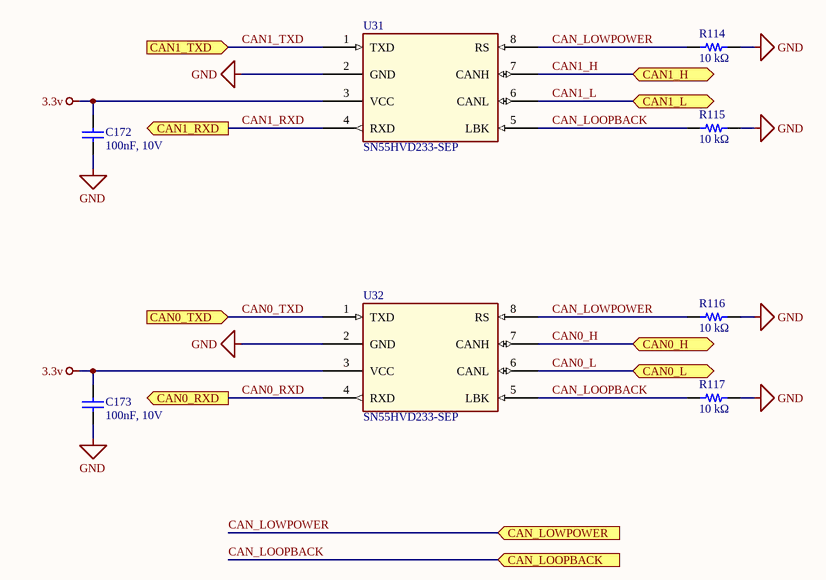
[diagram p14: CANTransceiver.SchDoc]

### Parts
C172  100nF, 10V  [WURTH_WCAP-CSGP_0402]
C173  100nF, 10V  [WURTH_WCAP-CSGP_0402]
R114  10 kΩ  [PANASONIC_ERJ2G_0402]
R115  10 kΩ  [PANASONIC_ERJ2G_0402]
R116  10 kΩ  [PANASONIC_ERJ2G_0402]
R117  10 kΩ  [PANASONIC_ERJ2G_0402]
U31  SN55HVD233-SEP  [TEXAS_SOIC8D]
U32  SN55HVD233-SEP  [TEXAS_SOIC8D]

### Ports
CAN0_H (bidir), CAN0_L (bidir), CAN0_RXD (out), CAN0_TXD (in), CAN1_H (bidir), CAN1_L (bidir), CAN1_RXD (out), CAN1_TXD (in), CAN_LOOPBACK (in), CAN_LOWPOWER (in)

### Nets
3.3v: C172.2 C173.2 U31.3(VCC) U32.3(VCC)
GND: C172.1 C173.1 R114.2 R115.2 R116.2 R117.2 U31.2(GND) U32.2(GND)
CAN0_H: U32.7(CANH) ; port CAN0_H
CAN0_L: U32.6(CANL) ; port CAN0_L
CAN0_RXD: U32.4(RXD) ; port CAN0_RXD
CAN0_TXD: U32.1(TXD) ; port CAN0_TXD
CAN1_H: U31.7(CANH) ; port CAN1_H
CAN1_L: U31.6(CANL) ; port CAN1_L
CAN1_RXD: U31.4(RXD) ; port CAN1_RXD
CAN1_TXD: U31.1(TXD) ; port CAN1_TXD
CAN_LOOPBACK: R115.1 R117.1 U31.5(LBK) U32.5(LBK) ; port CAN_LOOPBACK
CAN_LOWPOWER: R114.1 R116.1 U31.8(RS) U32.8(RS) ; port CAN_LOWPOWER

### Notes on the sheet
- Project:
- Title:
- Date:
- Designer:
- Sheet
- Revision:
- of
- Commit:

### Library data of the parts
C172 C173 = 885012205018: as C134 on sheet Clock; ComponentLink1Description: Manufacturer; ComponentLink1URL: http://www.we-online.de; ComponentLink2Description: Datasheet; ComponentLink2URL: https://www.we-online.com/catalog/datasheet/885012205018.pdf; Operating Temperature: -55 to +125degC; Packaging: Tape and Reel; Manufacturer Part Number: 885012205018; Published Date: April 2021; Ceramic Type: X7R; Height: 0.5mm; Mounting Technology: SMT; Size: 0402; Capacitance: 100nF; Q-Factor min.: -
R114-R117 = ERJ2RKF1002X: as R102 on sheet PowerSupply; Size (0402): 2GE; ComponentLink1Description: Catalog; ComponentLink1URL: https://industrial.panasonic.com/ww/products/pt/general-purpose-chip-resistors/models?op=search&model_status_current=1&page=0#model-list-search-results; Series: ERJ; Temperature Range (ºC): -55 to +155; Supplier 1: Digi-Key; Supplier 2: Mouser; Supplier Part Number 1: P10.0KLCT-ND; Supplier Part Number 2: 667-ERJ-2RKF1002X
U31 U32 = SN55HVD233-SEP: Radiation hardened 3.3V CAN transceiver in space enhanced plastic package with standby mode; Supply voltage (V): 3 to 3.6; Bus fault voltage (V): -16 to 16; Signaling rate (Max) (Mbps): 1; Common mode voltage (V): -7 to 12; Isolated: No; Single Event Latch-up (SEL): 43 MeV-cm2/mg; Total Ionizing Dose (TID): 20 krad(Si); ComponentLink1Description: Manufacturer; ComponentLink1URL: https://www.ti.com/product/SN55HVD233-SEP#pps; Rating: Space; Operating temperature range (C): -55 to 125; Package: SOIC 8

## Sheet PL_Ethernet.SchDoc: PL_Ethernet
size A3; Author: Carlos Barreiro; Organization: Escuela Técnica Superior de Ingeniería de Sistemas Informáticos de la Universidad Politécnica de Madrid; Address1: Campus Sur de la Universidad Politécnica de Madrid; Address2: Calle de Alan Turing, s/nº; Address3: Madrid 28031; Address4: España; DocumentNumber: 15; SheetNumber: 15; SheetTotal: 16
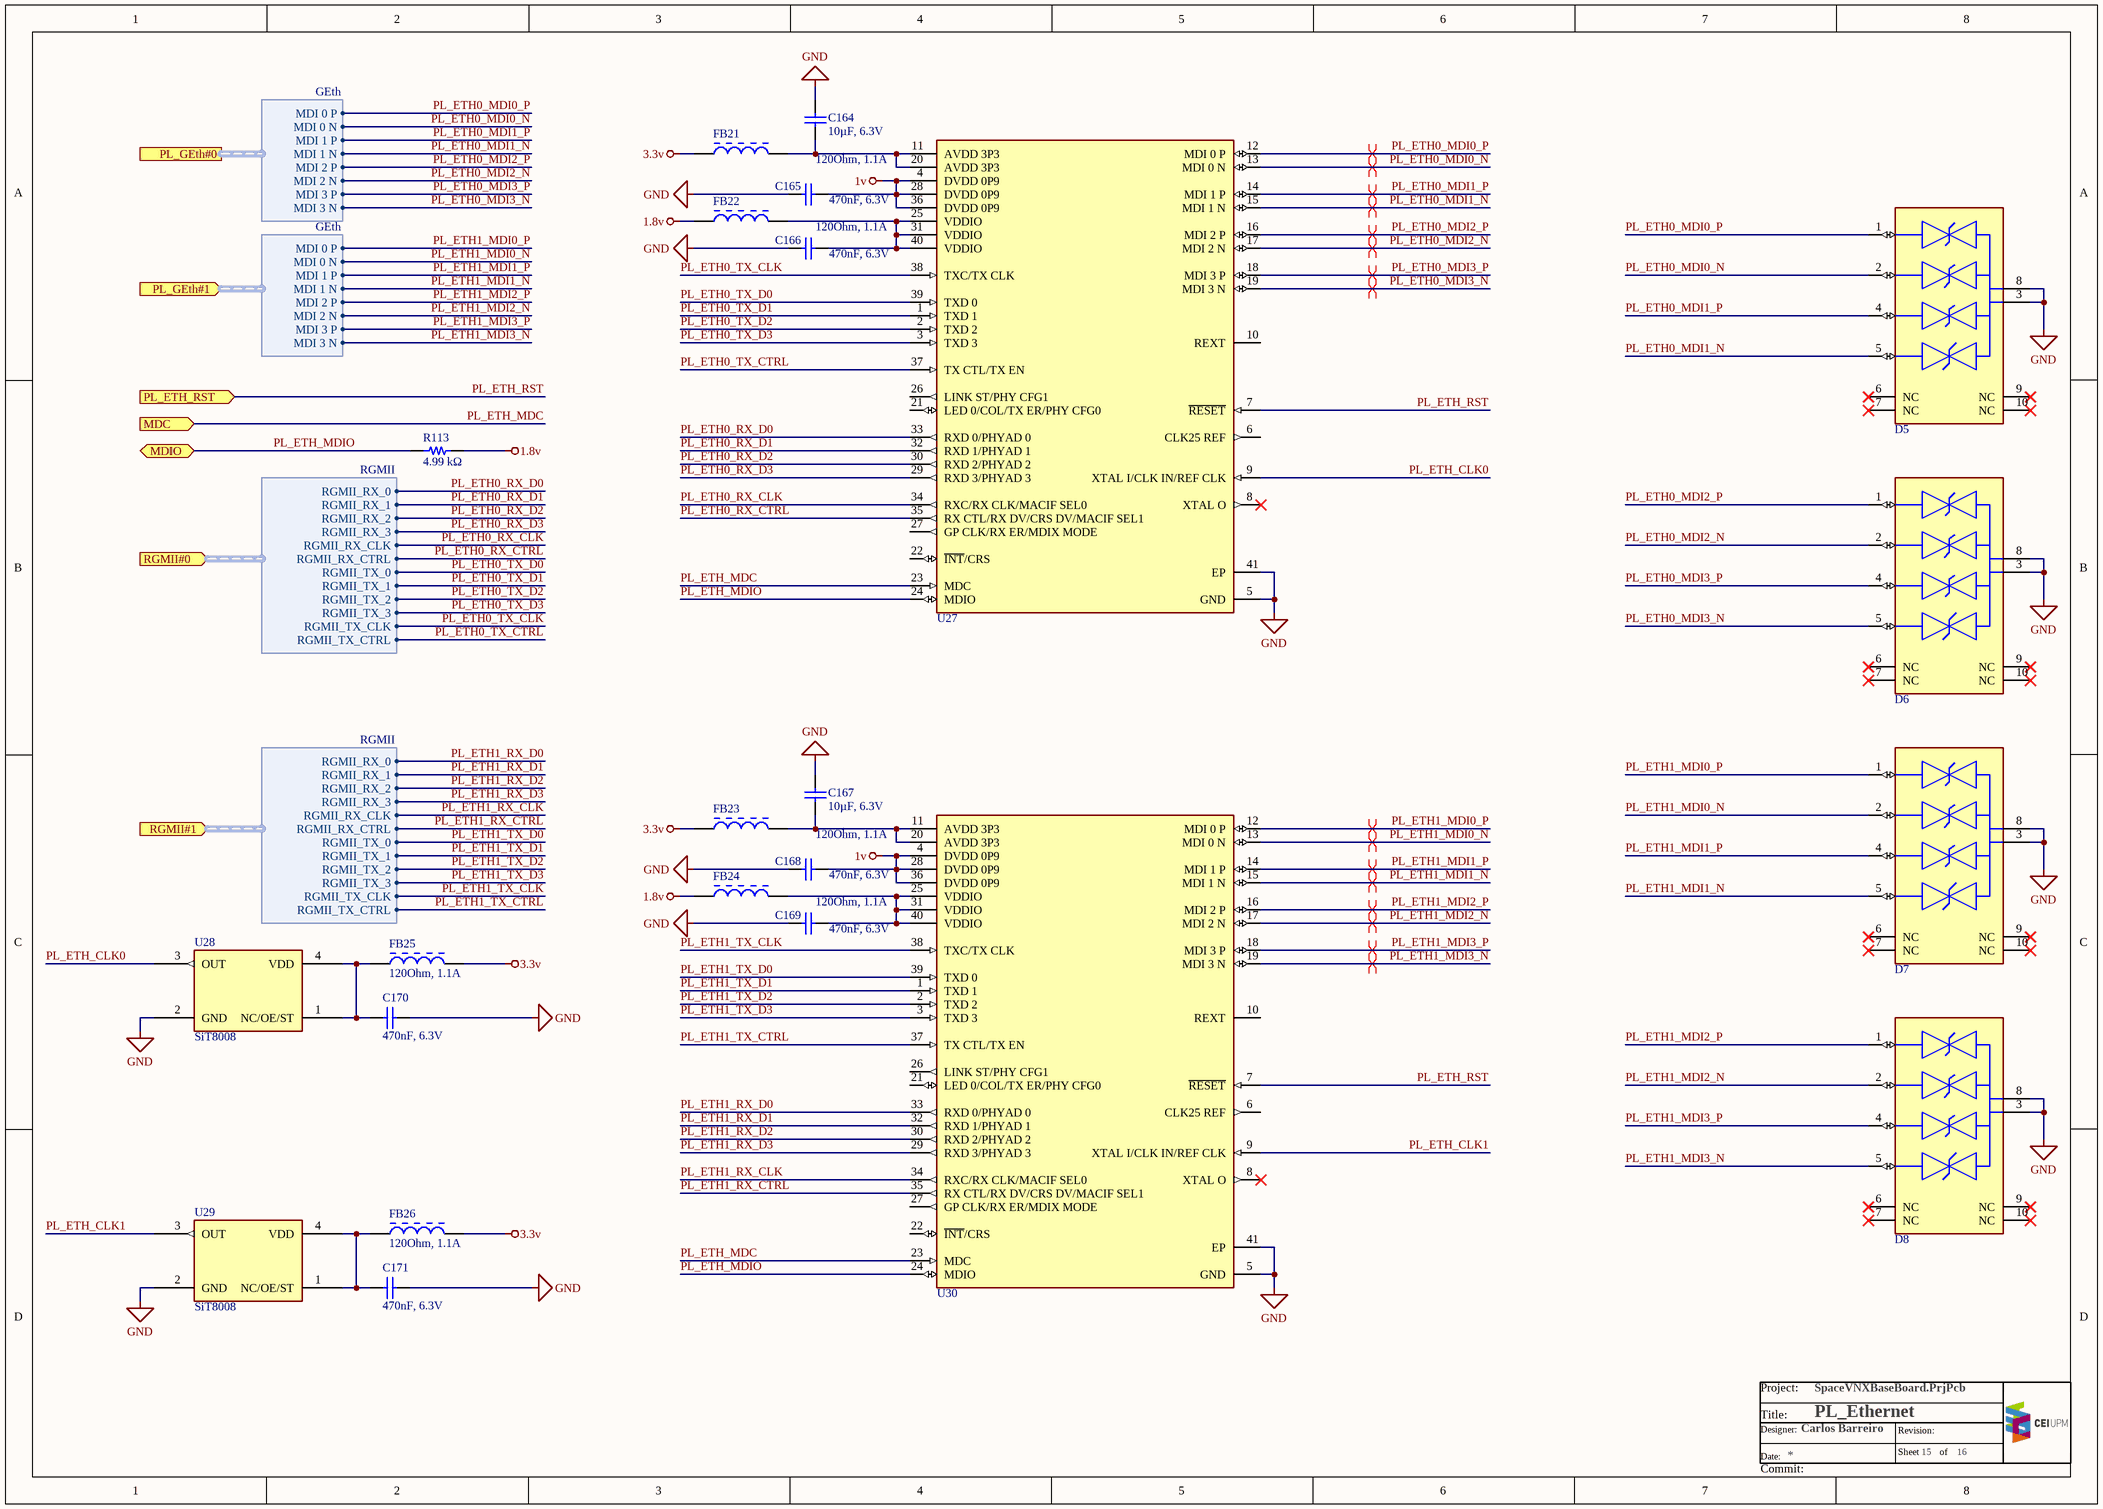
[diagram p15: PL_Ethernet.SchDoc]

### Parts
C164  10µF, 6.3V  [WURTH_WCAP-CSGP_0402]
C165  470nF, 6.3V  [WURTH_WCAP-CSGP_0402]
C166  470nF, 6.3V  [WURTH_WCAP-CSGP_0402]
C167  10µF, 6.3V  [WURTH_WCAP-CSGP_0402]
C168  470nF, 6.3V  [WURTH_WCAP-CSGP_0402]
C169  470nF, 6.3V  [WURTH_WCAP-CSGP_0402]
C170  470nF, 6.3V  [WURTH_WCAP-CSGP_0402]
C171  470nF, 6.3V  [WURTH_WCAP-CSGP_0402]
D5  ESD204DQAR  [TEXAS_USON10]  (value not drawn)
D6  ESD204DQAR  [TEXAS_USON10]  (value not drawn)
D7  ESD204DQAR  [TEXAS_USON10]  (value not drawn)
D8  ESD204DQAR  [TEXAS_USON10]  (value not drawn)
FB21  120Ohm, 1.1A  [WURTH-CBF_0402]
FB22  120Ohm, 1.1A  [WURTH-CBF_0402]
FB23  120Ohm, 1.1A  [WURTH-CBF_0402]
FB24  120Ohm, 1.1A  [WURTH-CBF_0402]
FB25  120Ohm, 1.1A  [WURTH-CBF_0402]
FB26  120Ohm, 1.1A  [WURTH-CBF_0402]
R113  4.99 kΩ  [PANASONIC_ERJ2G_0402]
U27  ADIN1300CCPZ  [ADI_LFCSP40]  (value not drawn)
U28  SiT8008  [SiTime_5032_4]
U29  SiT8008  [SiTime_5032_4]
U30  ADIN1300CCPZ  [ADI_LFCSP40]  (value not drawn)

### Ports
MDC (in), MDIO (bidir), PL_ETH_RST (in), PL_GEth#0 (harness GEth), PL_GEth#1 (in, harness GEth), RGMII#0 (in, harness RGMII), RGMII#1 (in, harness RGMII)

### Harnesses
GEth: MDI 0 P, MDI 0 N, MDI 1 P, MDI 1 N, MDI 2 P, MDI 2 N, MDI 3 P, MDI 3 N
RGMII: RGMII_RX_0, RGMII_RX_1, RGMII_RX_2, RGMII_RX_3, RGMII_RX_CLK, RGMII_RX_CTRL, RGMII_TX_0, RGMII_TX_1, RGMII_TX_2, RGMII_TX_3, RGMII_TX_CLK, RGMII_TX_CTRL

### Nets
1.8v: FB22.1 FB24.1 R113.2
1v: C165.2 C168.2 U27.4(DVDD_0P9) U27.28(DVDD_0P9) U27.36(DVDD_0P9) U30.4(DVDD_0P9) U30.28(DVDD_0P9) U30.36(DVDD_0P9)
3.3v: FB21.1 FB23.1 FB25.2 FB26.2
GND: C164.2 C165.1 C166.1 C167.2 C168.1 C169.1 C170.1 C171.1 D5.3(GND) D5.8(GND) D6.3(GND) D6.8(GND) D7.3(GND) D7.8(GND) D8.3(GND) D8.8(GND) U27.5(GND) U27.41(EP) U28.2(GND) U29.2(GND) U30.5(GND) U30.41(EP)
PL_ETH0_MDI0_N: D5.2(IO2) U27.13(MDI_0_N) ; port PL_GEth#0.MDI 0 N
PL_ETH0_MDI0_P: D5.1(IO1) U27.12(MDI_0_P) ; port PL_GEth#0.MDI 0 P
PL_ETH0_MDI1_N: D5.5(IO4) U27.15(MDI_1_N) ; port PL_GEth#0.MDI 1 N
PL_ETH0_MDI1_P: D5.4(IO3) U27.14(MDI_1_P) ; port PL_GEth#0.MDI 1 P
PL_ETH0_MDI2_N: D6.2(IO2) U27.17(MDI_2_N) ; port PL_GEth#0.MDI 2 N
PL_ETH0_MDI2_P: D6.1(IO1) U27.16(MDI_2_P) ; port PL_GEth#0.MDI 2 P
PL_ETH0_MDI3_N: D6.5(IO4) U27.19(MDI_3_N) ; port PL_GEth#0.MDI 3 N
PL_ETH0_MDI3_P: D6.4(IO3) U27.18(MDI_3_P) ; port PL_GEth#0.MDI 3 P
PL_ETH0_RX_CLK: U27.34(RXC/RX_CLK/MACIF_SEL0) ; port RGMII#0.RGMII_RX_CLK
PL_ETH0_RX_CTRL: U27.35(RX_CTL/RX_DV/CRS_DV/MACIF_SEL1) ; port RGMII#0.RGMII_RX_CTRL
PL_ETH0_RX_D0: U27.33(RXD_0/PHYAD_0) ; port RGMII#0.RGMII_RX_0
PL_ETH0_RX_D1: U27.32(RXD_1/PHYAD_1) ; port RGMII#0.RGMII_RX_1
PL_ETH0_RX_D2: U27.30(RXD_2/PHYAD_2) ; port RGMII#0.RGMII_RX_2
PL_ETH0_RX_D3: U27.29(RXD_3/PHYAD_3) ; port RGMII#0.RGMII_RX_3
PL_ETH0_TX_CLK: U27.38(TXC/TX_CLK) ; port RGMII#0.RGMII_TX_CLK
PL_ETH0_TX_CTRL: U27.37(TX_CTL/TX_EN) ; port RGMII#0.RGMII_TX_CTRL
PL_ETH0_TX_D0: U27.39(TXD_0) ; port RGMII#0.RGMII_TX_0
PL_ETH0_TX_D1: U27.1(TXD_1) ; port RGMII#0.RGMII_TX_1
PL_ETH0_TX_D2: U27.2(TXD_2) ; port RGMII#0.RGMII_TX_2
PL_ETH0_TX_D3: U27.3(TXD_3) ; port RGMII#0.RGMII_TX_3
PL_ETH1_MDI0_N: D7.2(IO2) U30.13(MDI_0_N) ; port PL_GEth#1.MDI 0 N
PL_ETH1_MDI0_P: D7.1(IO1) U30.12(MDI_0_P) ; port PL_GEth#1.MDI 0 P
PL_ETH1_MDI1_N: D7.5(IO4) U30.15(MDI_1_N) ; port PL_GEth#1.MDI 1 N
PL_ETH1_MDI1_P: D7.4(IO3) U30.14(MDI_1_P) ; port PL_GEth#1.MDI 1 P
PL_ETH1_MDI2_N: D8.2(IO2) U30.17(MDI_2_N) ; port PL_GEth#1.MDI 2 N
PL_ETH1_MDI2_P: D8.1(IO1) U30.16(MDI_2_P) ; port PL_GEth#1.MDI 2 P
PL_ETH1_MDI3_N: D8.5(IO4) U30.19(MDI_3_N) ; port PL_GEth#1.MDI 3 N
PL_ETH1_MDI3_P: D8.4(IO3) U30.18(MDI_3_P) ; port PL_GEth#1.MDI 3 P
PL_ETH1_RX_CLK: U30.34(RXC/RX_CLK/MACIF_SEL0) ; port RGMII#1.RGMII_RX_CLK
PL_ETH1_RX_CTRL: U30.35(RX_CTL/RX_DV/CRS_DV/MACIF_SEL1) ; port RGMII#1.RGMII_RX_CTRL
PL_ETH1_RX_D0: U30.33(RXD_0/PHYAD_0) ; port RGMII#1.RGMII_RX_0
PL_ETH1_RX_D1: U30.32(RXD_1/PHYAD_1) ; port RGMII#1.RGMII_RX_1
PL_ETH1_RX_D2: U30.30(RXD_2/PHYAD_2) ; port RGMII#1.RGMII_RX_2
PL_ETH1_RX_D3: U30.29(RXD_3/PHYAD_3) ; port RGMII#1.RGMII_RX_3
PL_ETH1_TX_CLK: U30.38(TXC/TX_CLK) ; port RGMII#1.RGMII_TX_CLK
PL_ETH1_TX_CTRL: U30.37(TX_CTL/TX_EN) ; port RGMII#1.RGMII_TX_CTRL
PL_ETH1_TX_D0: U30.39(TXD_0) ; port RGMII#1.RGMII_TX_0
PL_ETH1_TX_D1: U30.1(TXD_1) ; port RGMII#1.RGMII_TX_1
PL_ETH1_TX_D2: U30.2(TXD_2) ; port RGMII#1.RGMII_TX_2
PL_ETH1_TX_D3: U30.3(TXD_3) ; port RGMII#1.RGMII_TX_3
PL_ETH_CLK0: U27.9(XTAL_I/CLK_IN/REF_CLK) U28.3(OUT)
PL_ETH_CLK1: U29.3(OUT) U30.9(XTAL_I/CLK_IN/REF_CLK)
PL_ETH_MDC: U27.23(MDC) U30.23(MDC) ; port MDC
PL_ETH_MDIO: R113.1 U27.24(MDIO) U30.24(MDIO) ; port MDIO
PL_ETH_RST: U27.7(~{RESET}) U30.7(~{RESET}) ; port PL_ETH_RST
NetC164_1: C164.1 FB21.2 U27.11(AVDD_3P3) U27.20(AVDD_3P3)
NetC166_2: C166.2 FB22.2 U27.25(VDDIO) U27.31(VDDIO) U27.40(VDDIO)
NetC167_1: C167.1 FB23.2 U30.11(AVDD_3P3) U30.20(AVDD_3P3)
NetC169_2: C169.2 FB24.2 U30.25(VDDIO) U30.31(VDDIO) U30.40(VDDIO)
NetC170_2: C170.2 FB25.1 U28.1(NC/OE/ST) U28.4(VDD)
NetC171_2: C171.2 FB26.1 U29.1(NC/OE/ST) U29.4(VDD)

Not connected (* = marked no-connect by the designer): D5 6(NC)* 7(NC)* 9(NC)* 10(NC)*; D6 6(NC)* 7(NC)* 9(NC)* 10(NC)*; D7 6(NC)* 7(NC)* 9(NC)* 10(NC)*; D8 6(NC)* 7(NC)* 9(NC)* 10(NC)*; U27 6(CLK25_REF) 8(XTAL_O)* 10(REXT) 21(LED_0/COL/TX_ER/PHY_CFG0) 22(~{INT}/CRS) 26(LINK_ST/PHY_CFG1) 27(GP_CLK/RX_ER/MDIX_MODE); U30 6(CLK25_REF) 8(XTAL_O)* 10(REXT) 21(LED_0/COL/TX_ER/PHY_CFG0) 22(~{INT}/CRS) 26(LINK_ST/PHY_CFG1) 27(GP_CLK/RX_ER/MDIX_MODE)

### Layout directives
differential pair: PL_ETH0_MDI0_N, PL_ETH0_MDI0_P, PL_ETH0_MDI1_N, PL_ETH0_MDI1_P, PL_ETH0_MDI2_N, PL_ETH0_MDI2_P, PL_ETH0_MDI3_N, PL_ETH0_MDI3_P, PL_ETH1_MDI0_N, PL_ETH1_MDI0_P, PL_ETH1_MDI1_N, PL_ETH1_MDI1_P, PL_ETH1_MDI2_N, PL_ETH1_MDI2_P, PL_ETH1_MDI3_N, PL_ETH1_MDI3_P

### Notes on the sheet
- Project:
- Title:
- Date:
- Designer:
- Sheet
- Revision:
- of
- Commit:

### Library data of the parts
C164 C167 = 885012105020: as C121 on sheet Clock; ComponentLink1Description: Manufacturer; ComponentLink1URL: http://www.we-online.de; ComponentLink2Description: Datasheet; ComponentLink2URL: https://www.we-online.com/catalog/datasheet/885012105020.pdf; Operating Temperature: -55 to +85degC; Packaging: Tape and Reel; Manufacturer Part Number: 885012105020; Published Date: April 2021; Ceramic Type: X5R; Height: 0.5mm; Mounting Technology: SMT; Size: 0402; Capacitance: 10uF; Q-Factor min.: -
C165 C166 C168-C171 = 885012105004: as C120 on sheet Clock; ComponentLink1Description: Manufacturer; ComponentLink1URL: http://www.we-online.de; ComponentLink2Description: Datasheet; ComponentLink2URL: https://www.we-online.com/catalog/datasheet/885012105004.pdf; Operating Temperature: -55 to +85degC; Packaging: Tape and Reel; Manufacturer Part Number: 885012105004; Published Date: April 2021; Ceramic Type: X5R; Height: 0.5mm; Mounting Technology: SMT; Size: 0402; Capacitance: 470nF; Supplier 1: Digi-Key; Supplier 2: Mouser; Supplier Part Number 1: 732-7481-1-ND; Supplier Part Number 2: 710-885012105004
D5-D8 = ESD204DQAR: as D1 on sheet PS_Ethernet; Operating temperature range (C): -40ºC to 125ºC; ComponentLink1Description: Manufacturer; ComponentLink1URL: https://www.ti.com/product/ESD204; Supplier 1: Digi-Key; Supplier 2: Mouser; Supplier Part Number 1: 296-49504-1-ND; Supplier Part Number 2: 595-ESD204DQAR
FB21-FB26 = 74279271: as FB4 on sheet Clock; ComponentLink1Description: Manufacturer; ComponentLink1URL: http://www.we-online.de; ComponentLink2Description: Datasheet; ComponentLink2URL: https://www.we-online.com/catalog/datasheet/74279271.pdf; Operating Temperature: -55 to +125degC; Packaging: Tape and Reel; Published Date: December 2021; Rated Current: 1.1A; Manufacturer Part Number: 74279271; Impedance @100MHz: 120Ohm; Mounting Technology: SMT; Size: 0402; Height: 0.5mm; Length: 1mm; Width: 0.5mm
R113 = ERJ2RKF4991X: as R91 on sheet PowerSupply; Size (0402): 2GE; ComponentLink1Description: Catalog; ComponentLink1URL: https://industrial.panasonic.com/ww/products/pt/general-purpose-chip-resistors/models?op=search&model_status_current=1&page=0#model-list-search-results; Series: ERJ; Temperature Range (ºC): -55 to +155; Supplier 1: Digi-Key; Supplier Part Number 1: P4.99KLTR-ND
U27 U30 = ADIN1300CCPZ: as U23 on sheet PS_Ethernet; Package: 40-lead, 6 mm × 6 mm LFCSP; Operating Temperature: −40°C to +105°C; ComponentLink1Description: Manufacturer; ComponentLink1URL: https://www.analog.com/en/products/adin1300.html#product-tools; ComponentLink2Description: Application Note; ComponentLink2URL: https://wiki.analog.com/resources/eval/user-guides/adin1300-and-adin1200/cap-coupling#:~:text=The%20ADIN1300%20and%20ADIN1200%20are,10%2F100%20Mbps%20Ethernet%20speeds.; Supplier 1: Digi-Key; Supplier 2: Mouser; Supplier Part Number 2: 584-ADIN1300CCPZ; Supplier Part Number 1: 505-ADIN1300CCPZ-ND
U28 U29 = SiT8008: as U18 on sheet Clock; Operating Temperature Range (°C): -40ºC to +85ºC; ComponentLink1Description: Manufacturer; ComponentLink1URL: https://www.sitime.com/products/lvcmos-oscillators/sit8008; Supplier 1: Mouser; Supplier Part Number 1: 788-8008BI2333S1000G